# EAGLE schematic DM04r (EAGLE 6.6.0)

## Sheet 1 of 2
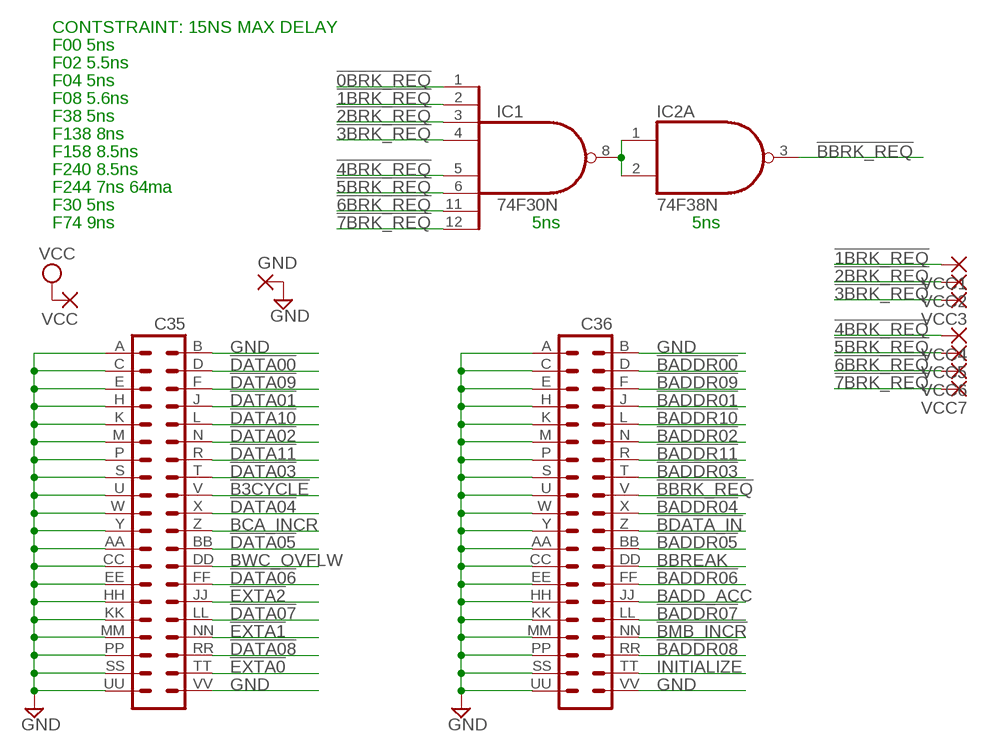
[diagram p0: schematic, sheet 1]

### Parts
C35  DEC40PINV  [DEC40PINV]
C36  DEC40PINV  [DEC40PINV]
GND  2,54/0,8  [2,54/0,8]
IC1  74F30N  74S30N  [DIL14]
IC2  74F38N  [DIL14]
VCC  2,54/0,8  [2,54/0,8]
VCC1  2,54/0,8  [2,54/0,8]
VCC2  2,54/0,8  [2,54/0,8]
VCC3  2,54/0,8  [2,54/0,8]
VCC4  2,54/0,8  [2,54/0,8]
VCC5  2,54/0,8  [2,54/0,8]
VCC6  2,54/0,8  [2,54/0,8]
VCC7  2,54/0,8  [2,54/0,8]

### Nets
!0BRK_REQ: IC1.1(I0) ; also sheet 2
!1BRK_REQ: IC1.2(I1) VCC1.1(P) ; also sheet 2
!2BRK_REQ: IC1.3(I2) VCC2.1(P) ; also sheet 2
!3BRK_REQ: IC1.4(I3) VCC3.1(P) ; also sheet 2
!4BRK_REQ: IC1.5(I4) VCC4.1(P) ; also sheet 2
!5BRK_REQ: IC1.6(I5) VCC5.1(P) ; also sheet 2
!6BRK_REQ: IC1.11(I6) VCC6.1(P) ; also sheet 2
!7BRK_REQ: IC1.12(I7) VCC7.1(P) ; also sheet 2
!B3CYCLE: C35.V
!BADDR00: C36.D ; also sheet 2
!BADDR01: C36.J ; also sheet 2
!BADDR02: C36.N ; also sheet 2
!BADDR03: C36.T ; also sheet 2
!BADDR04: C36.X ; also sheet 2
!BADDR05: C36.BB ; also sheet 2
!BADDR06: C36.FF ; also sheet 2
!BADDR07: C36.LL ; also sheet 2
!BADDR08: C36.RR ; also sheet 2
!BADDR09: C36.F ; also sheet 2
!BADDR10: C36.L ; also sheet 2
!BADDR11: C36.R ; also sheet 2
!BBRK_REQ: C36.V IC2.3(A:O)
!BDATA_IN: C36.Z
!BMB_INCR: C36.NN
!DATA00: C35.D ; also sheet 2
!DATA01: C35.J ; also sheet 2
!DATA02: C35.N ; also sheet 2
!DATA03: C35.T ; also sheet 2
!DATA04: C35.X ; also sheet 2
!DATA05: C35.BB ; also sheet 2
!DATA06: C35.FF ; also sheet 2
!DATA07: C35.LL ; also sheet 2
!DATA08: C35.RR ; also sheet 2
!DATA09: C35.F ; also sheet 2
!DATA10: C35.L ; also sheet 2
!DATA11: C35.R ; also sheet 2
!EXTA0: C35.TT ; also sheet 2
!EXTA1: C35.NN ; also sheet 2
!EXTA2: C35.JJ ; also sheet 2
BADD_ACC: C36.JJ
BBREAK: C36.DD
BCA_INCR: C35.Z
BWC_OVFLW: C35.DD
GND: C35.A C35.AA C35.B C35.C C35.CC C35.E C35.EE C35.H C35.HH C35.K C35.KK C35.M C35.MM C35.P C35.PP C35.S C35.SS C35.U C35.UU C35.VV C35.W C35.Y C36.A C36.AA C36.B C36.C C36.CC C36.E C36.EE C36.H C36.HH C36.K C36.KK C36.M C36.MM C36.P C36.PP C36.S C36.SS C36.U C36.UU C36.VV C36.W C36.Y GND.1(P) ; also sheet 2
INITIALIZE: C36.TT ; also sheet 2
N$1: IC1.8(O) IC2.1(A:I0) IC2.2(A:I1)
VCC: VCC.1(P) ; also sheet 2
Unconnected: IC2.4(B:I0) IC2.5(B:I1) IC2.6(B:O) IC2.8(C:O) IC2.9(C:I0) IC2.10(C:I1) IC2.11(D:O) IC2.12(D:I0) IC2.13(D:I1)

### Notes on the sheet
- CONTSTRAINT: 15NS MAX DELAY
- F00 5ns
- F02 5.5ns
- F04 5ns
- F08 5.6ns
- F38 5ns
- F138 8ns
- F158 8.5ns
- F240 8.5ns
- F244 7ns 64ma
- F30 5ns
- F74 9ns | 5ns | 5ns

## Sheet 2 of 2
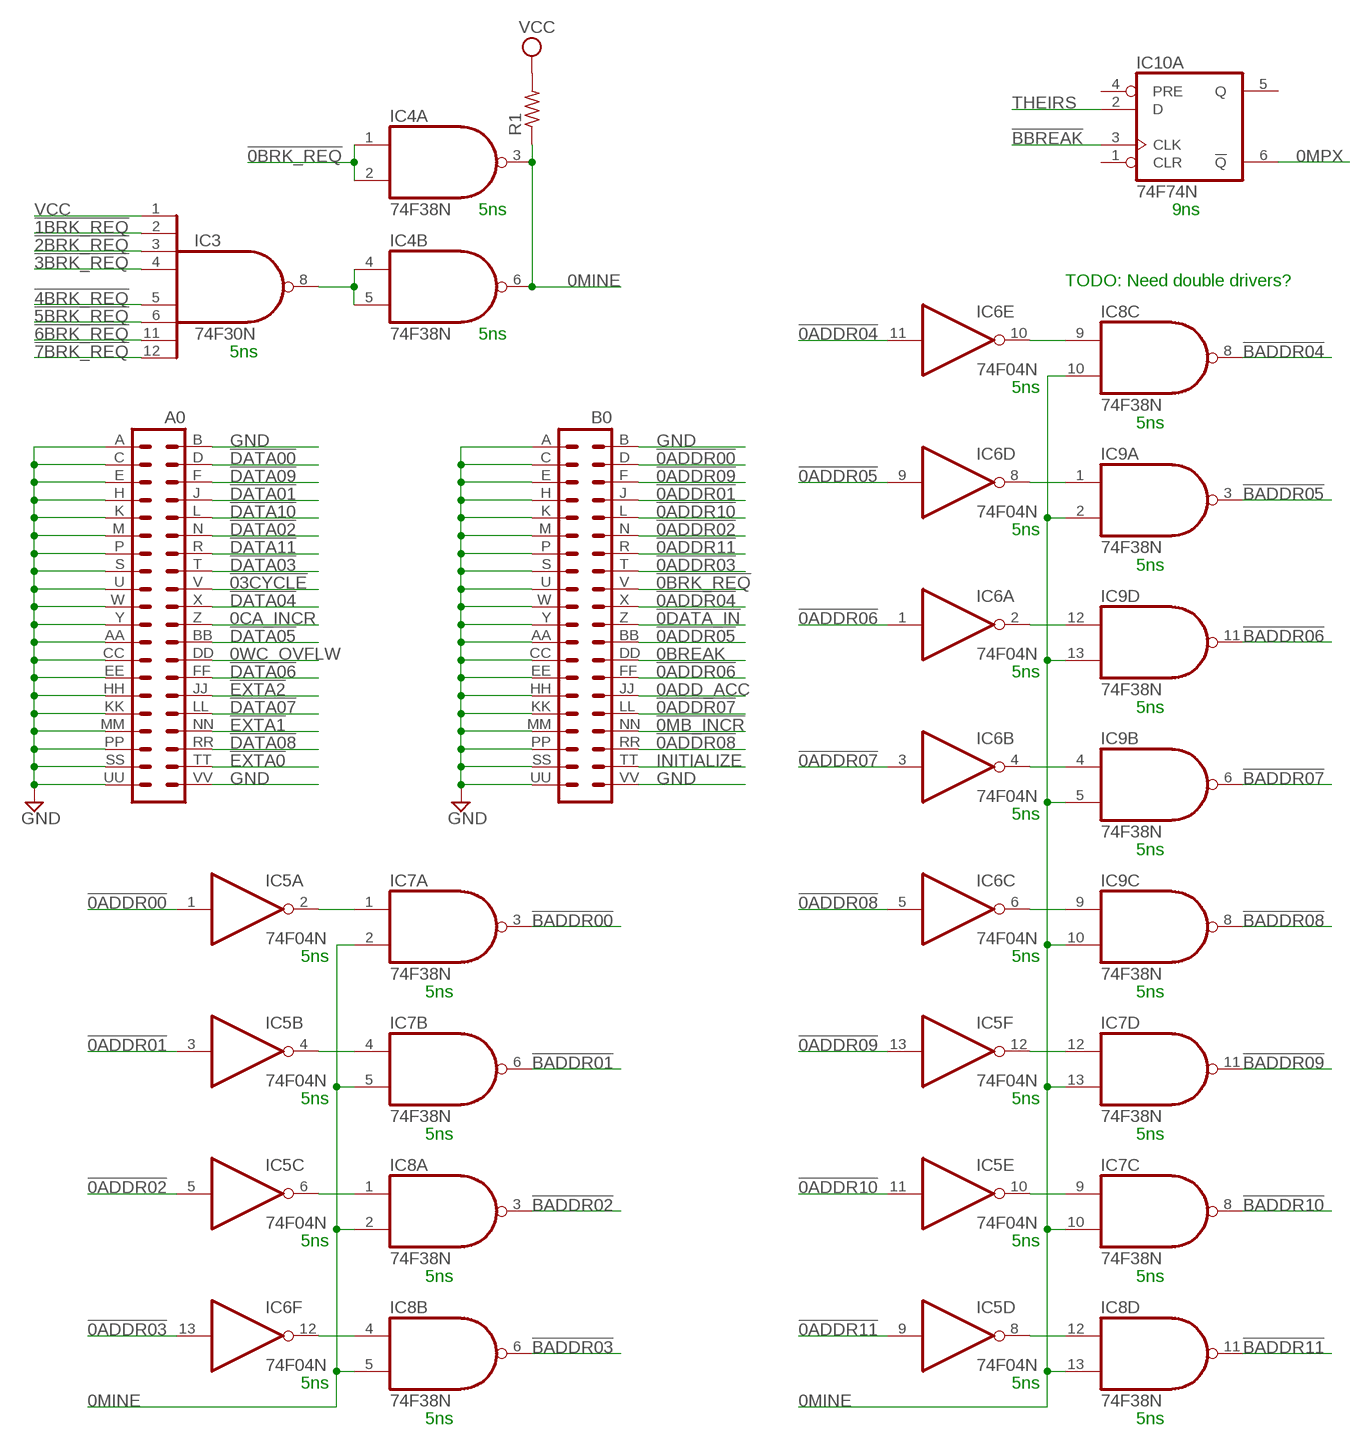
[diagram p1: schematic, sheet 2]

### Parts
A0  DEC40PINV  [DEC40PINV]
B0  DEC40PINV  [DEC40PINV]
IC3  74F30N  74S30N  [DIL14]
IC4  74F38N  [DIL14]
IC5  74F04N  74S04N  [DIL14]
IC6  74F04N  74S04N  [DIL14]
IC7  74F38N  [DIL14]
IC8  74F38N  [DIL14]
IC9  74F38N  [DIL14]
IC10  74F74N  74S74N  [DIL14]
R1  R-US_0207/10  [0207/10]

### Nets
0ADD_ACC: B0.JJ
0BREAK: B0.DD
0CA_INCR: A0.Z
0MINE: IC4.3(A:O) IC4.6(B:O) IC7.2(A:I1) IC7.5(B:I1) IC7.10(C:I1) IC7.13(D:I1) IC8.2(A:I1) IC8.5(B:I1) IC8.10(C:I1) IC8.13(D:I1) IC9.2(A:I1) IC9.5(B:I1) IC9.10(C:I1) IC9.13(D:I1) R1.1
0MPX: IC10.6(A:!Q)
0WC_OVFLW: A0.DD
!0ADDR00: B0.D IC5.1(A:I)
!0ADDR01: B0.J IC5.3(B:I)
!0ADDR02: B0.N IC5.5(C:I)
!0ADDR03: B0.T IC6.13(F:I)
!0ADDR04: B0.X IC6.11(E:I)
!0ADDR05: B0.BB IC6.9(D:I)
!0ADDR06: B0.FF IC6.1(A:I)
!0ADDR07: B0.LL IC6.3(B:I)
!0ADDR08: B0.RR IC6.5(C:I)
!0ADDR09: B0.F IC5.13(F:I)
!0ADDR10: B0.L IC5.11(E:I)
!0ADDR11: B0.R IC5.9(D:I)
!0BRK_REQ: B0.V IC4.1(A:I0) IC4.2(A:I1) ; also sheet 1
!0DATA_IN: B0.Z
!0MB_INCR: B0.NN
!1BRK_REQ: IC3.2(I1) ; also sheet 1
!2BRK_REQ: IC3.3(I2) ; also sheet 1
!3BRK_REQ: IC3.4(I3) ; also sheet 1
!03CYCLE: A0.V
!4BRK_REQ: IC3.5(I4) ; also sheet 1
!5BRK_REQ: IC3.6(I5) ; also sheet 1
!6BRK_REQ: IC3.11(I6) ; also sheet 1
!7BRK_REQ: IC3.12(I7) ; also sheet 1
!BADDR00: IC7.3(A:O) ; also sheet 1
!BADDR01: IC7.6(B:O) ; also sheet 1
!BADDR02: IC8.3(A:O) ; also sheet 1
!BADDR03: IC8.6(B:O) ; also sheet 1
!BADDR04: IC8.8(C:O) ; also sheet 1
!BADDR05: IC9.3(A:O) ; also sheet 1
!BADDR06: IC9.11(D:O) ; also sheet 1
!BADDR07: IC9.6(B:O) ; also sheet 1
!BADDR08: IC9.8(C:O) ; also sheet 1
!BADDR09: IC7.11(D:O) ; also sheet 1
!BADDR10: IC7.8(C:O) ; also sheet 1
!BADDR11: IC8.11(D:O) ; also sheet 1
!BBREAK: IC10.3(A:CLK)
!DATA00: A0.D ; also sheet 1
!DATA01: A0.J ; also sheet 1
!DATA02: A0.N ; also sheet 1
!DATA03: A0.T ; also sheet 1
!DATA04: A0.X ; also sheet 1
!DATA05: A0.BB ; also sheet 1
!DATA06: A0.FF ; also sheet 1
!DATA07: A0.LL ; also sheet 1
!DATA08: A0.RR ; also sheet 1
!DATA09: A0.F ; also sheet 1
!DATA10: A0.L ; also sheet 1
!DATA11: A0.R ; also sheet 1
!EXTA0: A0.TT ; also sheet 1
!EXTA1: A0.NN ; also sheet 1
!EXTA2: A0.JJ ; also sheet 1
GND: A0.A A0.AA A0.B A0.C A0.CC A0.E A0.EE A0.H A0.HH A0.K A0.KK A0.M A0.MM A0.P A0.PP A0.S A0.SS A0.U A0.UU A0.VV A0.W A0.Y B0.A B0.AA B0.B B0.C B0.CC B0.E B0.EE B0.H B0.HH B0.K B0.KK B0.M B0.MM B0.P B0.PP B0.S B0.SS B0.U B0.UU B0.VV B0.W B0.Y ; also sheet 1
INITIALIZE: B0.TT ; also sheet 1
N$3: IC6.10(E:O) IC8.9(C:I0)
N$4: IC3.8(O) IC4.4(B:I0) IC4.5(B:I1)
N$5: IC6.8(D:O) IC9.1(A:I0)
N$7: IC6.2(A:O) IC9.12(D:I0)
N$9: IC6.4(B:O) IC9.4(B:I0)
N$11: IC6.6(C:O) IC9.9(C:I0)
N$13: IC5.12(F:O) IC7.12(D:I0)
N$15: IC5.10(E:O) IC7.9(C:I0)
N$17: IC5.8(D:O) IC8.12(D:I0)
N$19: IC5.2(A:O) IC7.1(A:I0)
N$21: IC5.4(B:O) IC7.4(B:I0)
N$23: IC5.6(C:O) IC8.1(A:I0)
N$25: IC6.12(F:O) IC8.4(B:I0)
THEIRS: IC10.2(A:D)
VCC: IC3.1(I0) R1.2 ; also sheet 1
Unconnected: IC4.8(C:O) IC4.9(C:I0) IC4.10(C:I1) IC4.11(D:O) IC4.12(D:I0) IC4.13(D:I1) IC10.1(A:CLR) IC10.4(A:PRE) IC10.5(A:Q) IC10.8(B:!Q) IC10.9(B:Q) IC10.10(B:PRE) IC10.11(B:CLK) IC10.12(B:D) IC10.13(B:CLR)

### Notes on the sheet
- 5ns | 9ns
- TODO: Need double drivers?
- 5ns
- 5ns
- 5ns
- 5ns
- 5ns
- 5ns
- 5ns
- 5ns
- 5ns
- 5ns
- 5ns | 5ns
- 5ns | 5ns
- 5ns | 5ns
- 5ns | 5ns
- 5ns | 5ns
- 5ns | 5ns
- 5ns | 5ns
- 5ns | 5ns

## Power pins joined to a net without a drawn wire
GND: IC1.7(GND) IC2.7(P:GND) IC3.7(GND) IC4.7(P:GND) IC5.7(P:GND) IC6.7(P:GND) IC7.7(P:GND) IC8.7(P:GND) IC9.7(P:GND) IC10.7(P:GND)
VCC: IC1.14(VCC) IC2.14(P:VCC) IC3.14(VCC) IC4.14(P:VCC) IC5.14(P:VCC) IC6.14(P:VCC) IC7.14(P:VCC) IC8.14(P:VCC) IC9.14(P:VCC) IC10.14(P:VCC)

## Library data of the parts
A0 B0 C35 C36 = dec-con:DEC40PIN: PIN HEADER
GND VCC VCC1-VCC7 = wirepad:2,54/0,8: THROUGH-HOLE PAD
IC1 IC3 = 74xx-us:74*30: 8-input NAND gate
IC2 IC4 IC7-IC9 = dec-con:74*38: Quad 2-input NAND gate, open collector output
IC5 IC6 = 74xx-us:74*04: Hex INVERTER
IC10 = 74xx-us:74*74: Dual D type positive edge triggered FLIP FLOP, preset and clear
R1 = rcl:R-US_: RESISTOR, American symbol